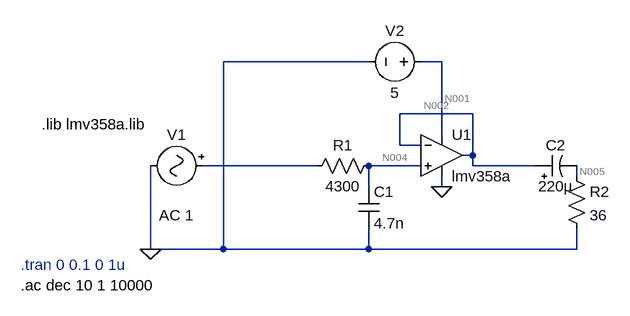
[diagram p0: schematic analise_Freq.asc]
analise_Freq.asc, the LTspice schematic file:
Version 4.1
SHEET 1 880 680
WIRE 352 -64 128 -64
WIRE 464 -64 432 -64
WIRE 512 16 400 16
WIRE 464 48 464 -64
WIRE 400 64 400 16
WIRE 432 64 400 64
WIRE 512 80 512 16
WIRE 512 80 496 80
WIRE 272 96 96 96
WIRE 432 96 352 96
WIRE 512 96 512 80
WIRE 608 96 512 96
WIRE 672 112 672 96
WIRE 352 128 352 96
WIRE 464 128 464 112
WIRE 16 224 16 96
WIRE 128 224 128 -64
WIRE 128 224 16 224
WIRE 352 224 352 192
WIRE 352 224 128 224
WIRE 672 224 672 192
WIRE 672 224 352 224
FLAG 16 224 0
FLAG 464 128 0
SYMBOL Misc\\signal 112 96 R90
WINDOW 0 -32 56 VBottom 2
WINDOW 3 88 56 VTop 2
WINDOW 123 60 56 VTop 2
WINDOW 39 0 0 Left 0
SYMATTR InstName V1
SYMATTR Value ""
SYMATTR Value2 AC 1
SYMBOL res 368 80 R90
WINDOW 0 0 56 VBottom 2
WINDOW 3 32 56 VTop 2
SYMATTR InstName R1
SYMATTR Value 4300
SYMBOL cap 336 128 R0
SYMATTR InstName C1
SYMATTR Value 4.7n
SYMBOL polcap 608 112 R270
WINDOW 0 32 32 VTop 2
WINDOW 3 0 32 VBottom 2
SYMATTR InstName C2
SYMATTR Value 220µ
SYMBOL res 656 96 R0
SYMATTR InstName R2
SYMATTR Value 36
SYMBOL voltage 448 -64 R90
WINDOW 0 -32 56 VBottom 2
WINDOW 3 32 56 VTop 2
SYMATTR InstName V2
SYMATTR Value 5
SYMBOL OpAmps\\opamp2 464 16 R0
SYMATTR InstName U1
SYMATTR Value lmv358a
SYMATTR SpiceModel lmv358a
TEXT -184 248 Left 2 ;.tran 0 0.1 0 1u
TEXT -184 280 Left 2 !.ac dec 10 1 10000
TEXT -152 32 Left 2 !.lib lmv358a.lib

The netlist it stands for:
* analise_Freq.asc
V1 N003 0 AC 1
R1 N004 N003 4300
C1 N004 0 4.7n
C2 N002 N005 220µ
R2 N005 0 36
V2 N001 0 5
X§U1 N004 N002 N001 0 N002 lmv358a lmv358a  ; pins In+ In- V+ V- OUT
* .tran 0 0.1 0 1u
.ac dec 10 1 10000
.lib lmv358a.lib
.backanno
.end

* Results of the author's LTspice run, read from the files saved beside the schematic
* Operating Point, zero values left out:
*   V(n004) = 10.75 nV
*   V(n001) = 5 V
*   V(n002) = 8.766 mV
*   I(V1) = 2.5 pA
*   I(V2) = -80 µA
*   I(R1) = 2.5 pA
*   Ix(u1:in+) = -2.5 pA
*   Ix(u1:in-) = -5.456 pA
*   Ix(u1:vcc) = 80 µA
*   Ix(u1:vee) = -80 µA
*   Ix(u1:out) = 5.456 pA
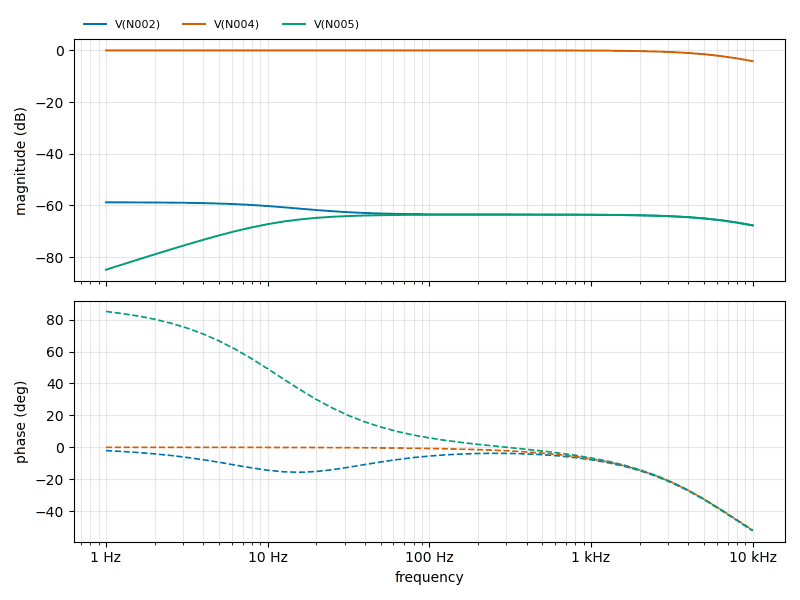
[diagram p1: AC Analysis of analise_Freq.asc, plotted from the saved traces]
* AC Analysis, 1 run:
*   V(N002): -58.82 dB at 1 Hz, -67.74 dB at 10 kHz, peak -58.82 dB at 1 Hz, 3 dB below the peak at 20.35 Hz
*   V(N004): -0.00 dB at 1 Hz, -4.18 dB at 10 kHz, peak -0.00 dB at 1 Hz, 3 dB below the peak at 7.856 kHz
*   V(N005): -84.89 dB at 1 Hz, -67.74 dB at 10 kHz, peak -63.58 dB at 316.2 Hz, 3 dB below the peak at 11.64 Hz and 7.881 kHz